# Altium schematic sheet VFD_alpha_Sheet1.SchDoc
size A4
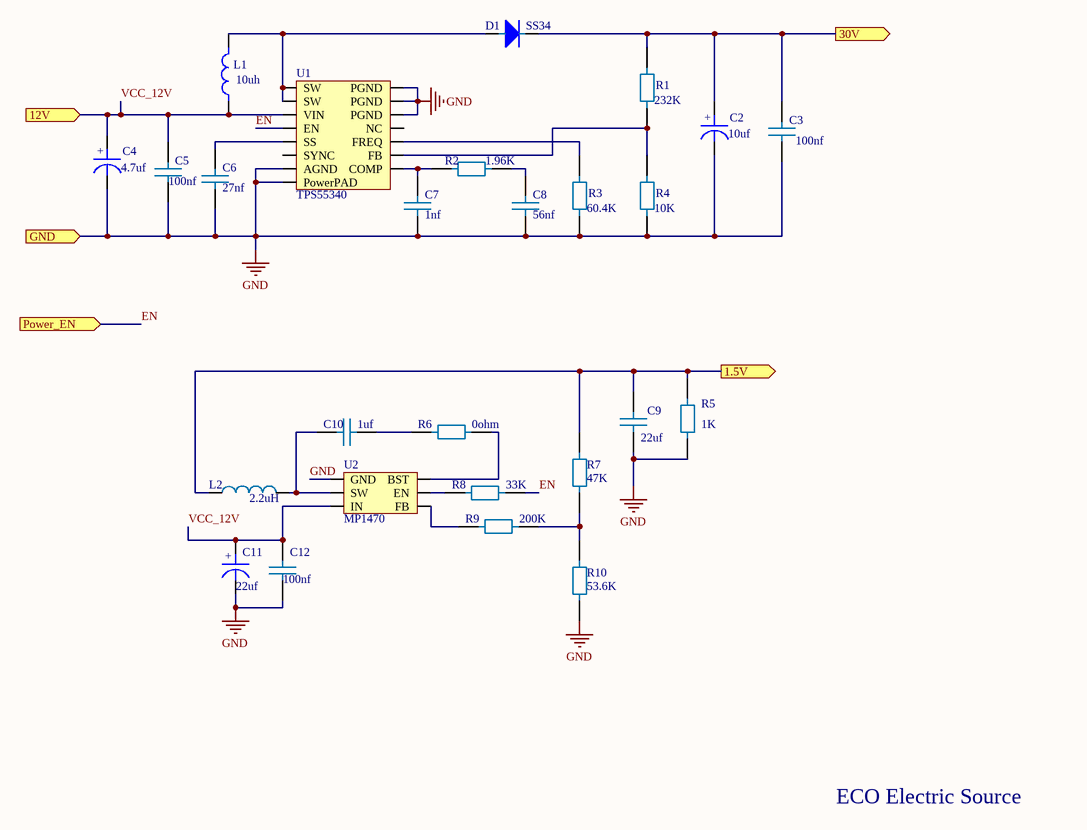
[diagram p0: VFD_alpha_Sheet1.SchDoc]

## Parts
C2  value 10uf  [CAP_5_2]
C3  value 100nf  [0805]  (hidden comment: C(0805))
C4  value 4.7uf  [CAP_5_2]
C5  value 100nf  [0805]  (hidden comment: C(0805))
C6  value 27nf  [0805]  (hidden comment: C(0805))
C7  value 1nf  [0805]  (hidden comment: C(0805))
C8  value 56nf  [0805]  (hidden comment: C(0805))
C9  value 22uf  [1206]  (hidden comment: C(1206))
C10  value 1uf  [0805]  (hidden comment: C(0805))
C11  value 22uf  [CAP_5_2]  (hidden comment: CAP_D5)
C12  value 100nf  [0805]  (hidden comment: C(0805))
D1  SS34  [DO-214AC]
L1  value 10uh  [INDP6.0*6.0*4.7]  (hidden comment: 功率电感(6045))
L2  value 2.2uH  [INDP3.0*3.0*1.5]  (hidden comment: 功率电感(3015))
R1  value 232K  [0805]  (hidden comment: R(0805))
R2  value 1.96K  [0805]  (hidden comment: R(0805))
R3  value 60.4K  [0805]  (hidden comment: R(0805))
R4  value 10K  [0805]  (hidden comment: R(0805))
R5  value 1K  [0805]  (hidden comment: R(0805))
R6  value 0ohm  [0805]  (hidden comment: R(0805))
R7  value 47K  [0805]  (hidden comment: R(0805))
R8  value 33K  [0805]  (hidden comment: R(0805))
R9  value 200K  [0805]  (hidden comment: R(0805))
R10  value 53.6K  [0805]  (hidden comment: R(0805))
U1  TPS55340  [PWP_TPS55340]
U2  MP1470  [SOT95-6N-MT3608]

## Ports
1.5V (out), 12V (in), 30V (out), GND (in), Power_EN (in)

## Nets
GND: C2.2 C3.1 C4.2 C5.1 C6.1 C7.1 C8.2 C9.1 C11.2 C12.1 R3.1 R4.1 R5.1 R10.1 U1.0(PowerPAD) U1.7(AGND) U1.12(PGND) U1.13(PGND) U1.14(PGND) U2.1(GND) ; port GND
1.5V: C9.2 L2.1 R5.2 R7.2 ; port 1.5V
30V: C2.1 C3.2 D1.2 R1.2 ; port 30V
EN: R8.2 U1.4(EN) ; port Power_EN
VCC_12V: C4.1 C5.2 C11.1 C12.2 L1.1 U1.3(VIN) U2.3(IN) ; port 12V
NetC6_2: C6.2 U1.5(SS)
NetC7_2: C7.2 R2.1 U1.8(COMP)
NetC8_1: C8.1 R2.2
NetC10_1: C10.1 L2.2 U2.2(SW)
NetC10_2: C10.2 R6.1
NetD1_1: D1.1 L1.2 U1.1(SW) U1.2(SW)
NetR1_1: R1.1 R4.2 U1.9(FB)
NetR3_2: R3.2 U1.10(FREQ)
NetR6_2: R6.2 U2.6(BST)
NetR7_1: R7.1 R9.2 R10.2
NetR8_1: R8.1 U2.5(EN)
NetR9_1: R9.1 U2.4(FB)

Not connected (* = marked no-connect by the designer): U1 6(SYNC) 11(NC)

## Notes on the sheet
- ECO Electric Source
- (in symbol CAP_D5) +

## Library data of the parts
C2 C4 = CAP_D5